# EAGLE design eeZeeISP (EAGLE 6.4)
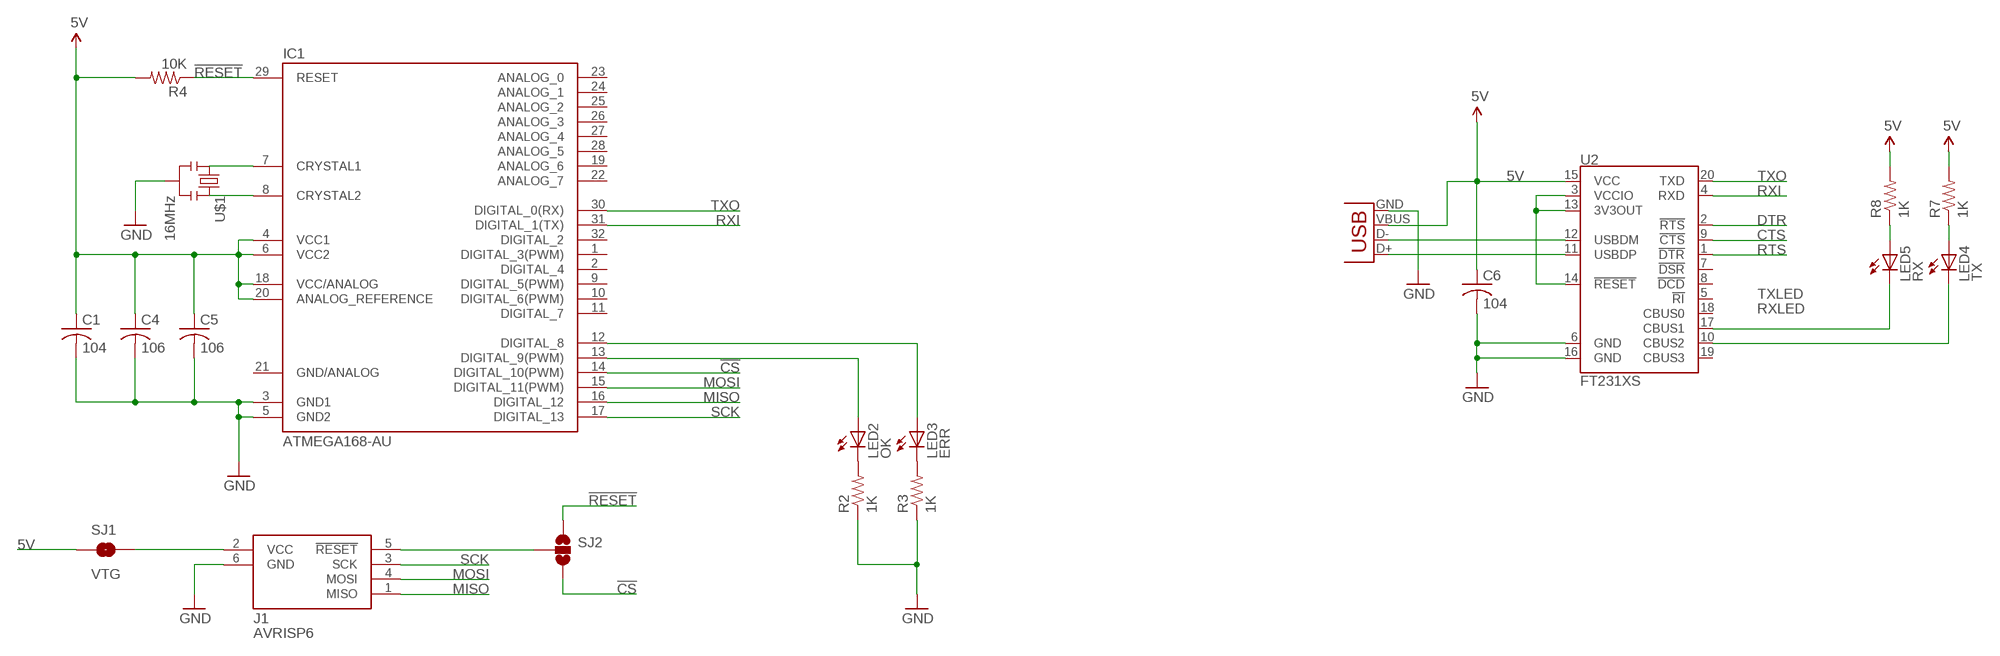
[diagram p0: schematic, sheet 1]

## Parts
C1  104  C-USC0603  [C0603]
C4  106  C-USC0603  [C0603]
C5  106  C-USC0603  [C0603]
C6  104  C-USC0603  [C0603]
IC1  ATMEGA168-AU  [TQFP32-08]
J1  AVRISP6  [CON6P2R]
LED2  OK  LEDCHIPLED_1206  [CHIPLED_1206]
LED3  ERR  LEDCHIPLED_1206  [CHIPLED_1206]
LED4  TX  LEDCHIPLED_1206  [CHIPLED_1206]
LED5  RX  LEDCHIPLED_1206  [CHIPLED_1206]
R2  1K  R-US_R0603  [R0603]
R3  1K  R-US_R0603  [R0603]
R4  10K  R-US_R0603  [R0603]
R7  1K  R-US_R0603  [R0603]
R8  1K  R-US_R0603  [R0603]
SJ1  VTG  SOLDERJUMPERNO  [SJ_2S-NO]
SJ2  SOLDERJUMPER_2WAYS  [SJ_3]
U2  FT231XS  [SSOP20_L]
U$1  16MHz  RESONATOR_CSTCE_V_C  [CSTCE_V_C]
X2  USB-SMD-NS  [USB-MINIB-NOSTOP]

## Nets
5V: C1.1 C4.1 C5.1 C6.1 IC1.4(VCC1) IC1.6(VCC2) IC1.18(VCC/ANALOG) IC1.20(ANALOG_REFERENCE) R4.2 R7.2 R8.2 SJ1.1 U2.15(VCC) X2.VBUS
!CS: IC1.14(DIGITAL_10(PWM)) SJ2.3
!RESET: IC1.29(RESET) R4.1 SJ2.1
CTS: U2.9(!CTS)
DTR: U2.1(!DTR)
GND: C1.2 C4.2 C5.2 C6.2 IC1.3(GND1) IC1.5(GND2) J1.6(GND) R2.1 R3.1 U2.6(GND) U2.16(GND) U$1.GND X2.GND
MISO: IC1.16(DIGITAL_12) J1.1(MISO)
MOSI: IC1.15(DIGITAL_11(PWM)) J1.4(MOSI)
N$1: LED4.A R7.1
N$2: LED5.A R8.1
N$3: J1.2(VCC) SJ1.2
N$4: J1.5(!RESET) SJ2.2
N$6: IC1.13(DIGITAL_9(PWM)) LED2.A
N$7: IC1.12(DIGITAL_8) LED3.A
N$8: IC1.7(CRYSTAL1) U$1.X1
N$9: U2.3(VCCIO) U2.13(3V3OUT) U2.14(!RESET)
N$10: LED2.C R2.2
N$11: LED3.C R3.2
N$13: IC1.8(CRYSTAL2) U$1.X2
RTS: U2.2(!RTS)
RXI: IC1.31(DIGITAL_1(TX)) U2.4(RXD)
RXLED: LED5.C U2.17(CBUS1)
SCK: IC1.17(DIGITAL_13) J1.3(SCK)
TXLED: LED4.C U2.10(CBUS2)
TXO: IC1.30(DIGITAL_0(RX)) U2.20(TXD)
USB_D+: U2.11(USBDP) X2.D+
USB_D-: U2.12(USBDM) X2.D-
Unconnected: IC1.1(DIGITAL_3(PWM)) IC1.2(DIGITAL_4) IC1.9(DIGITAL_5(PWM)) IC1.10(DIGITAL_6(PWM)) IC1.11(DIGITAL_7) IC1.19(ANALOG_6) IC1.22(ANALOG_7) IC1.23(ANALOG_0) IC1.24(ANALOG_1) IC1.25(ANALOG_2) IC1.26(ANALOG_3) IC1.27(ANALOG_4) IC1.28(ANALOG_5) IC1.32(DIGITAL_2) U2.5(!RI) U2.7(!DSR) U2.8(!DCD) U2.18(CBUS0) U2.19(CBUS3)

## Power pins joined to a net without a drawn wire
GND/ANALOG: IC1.21(GND/ANALOG)

## Library data of the parts
C1 C4-C6 = rcl:C-US: CAPACITOR, American symbol
IC1 = Arduino-AVR:ATMEGA168
J1 = bt_avr:AVRISP6: 6-pin dual-row connector for Atmel AVRISP programmer interface
LED2-LED5 = bt_opto:LED: LED Various packages
R2-R4 R7 R8 = rcl:R-US_: RESISTOR, American symbol
SJ1 = SparkFun:SOLDERJUMPER: Solder Jumper Standard SMD solder jumper. Used to automate production. Two varients : Normally Open and Normally Closed are the same, but have different paste layers. NC will have a large amount of paste and should jumper during reflow.
SJ2 = SparkFun:SOLDERJUMPER_2WAY: Solder Jumper 2 way solder jumper
U2 = SparkFun-DigitalIC:FT231X: FTDI FT231X Full Speed USB to Full-handshake UART This USB2.0 Full Speed IC offers a compact bridge to full handshake UART interfaces. The device is a UART, capable of operating up to 3MBaud, with low power consumption (8mA). The FT231X includes the complete FT-X series feature set and enables USB to be added into a system design quickly and easily over a UART interface.
U$1 = bt_crystal:RESONATOR: Crystal Resonator, 3-pin
X2 = SparkFun:USB: USB Connectors USB-B-PTH is fully proven SKU : PRT-00139 USB-miniB is fully proven SKU : PRT-00587 USB-A-PCB is untested. USB-A-H is throughly reviewed, but untested. Spark Fun Electronics SKU : PRT-00437 USB-B-SMT is throughly reviewed, but untested. Needs silkscreen touching up. USB-A-S has not been used/tested USB-MB-H has not been used/tested

## Net classes
1 power: width 0.254 mm

## Board
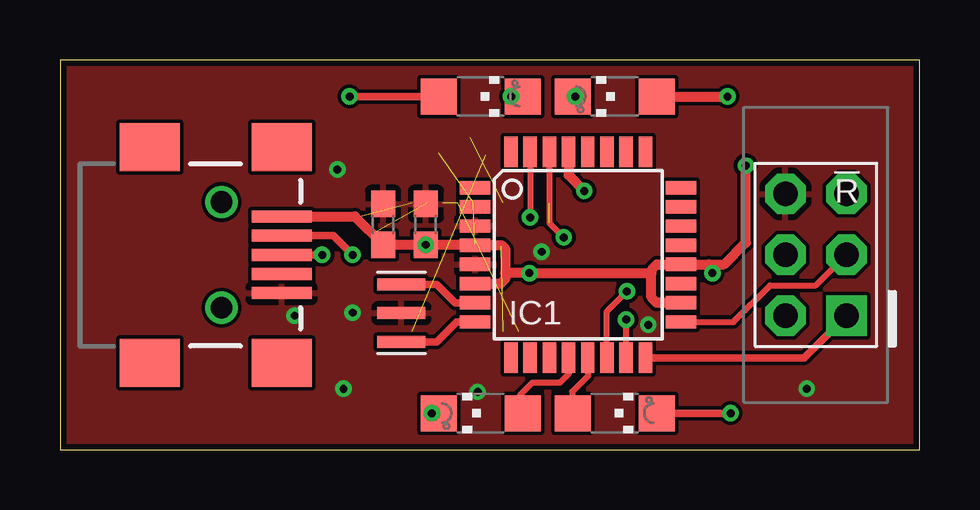
[diagram p1: board, top side]
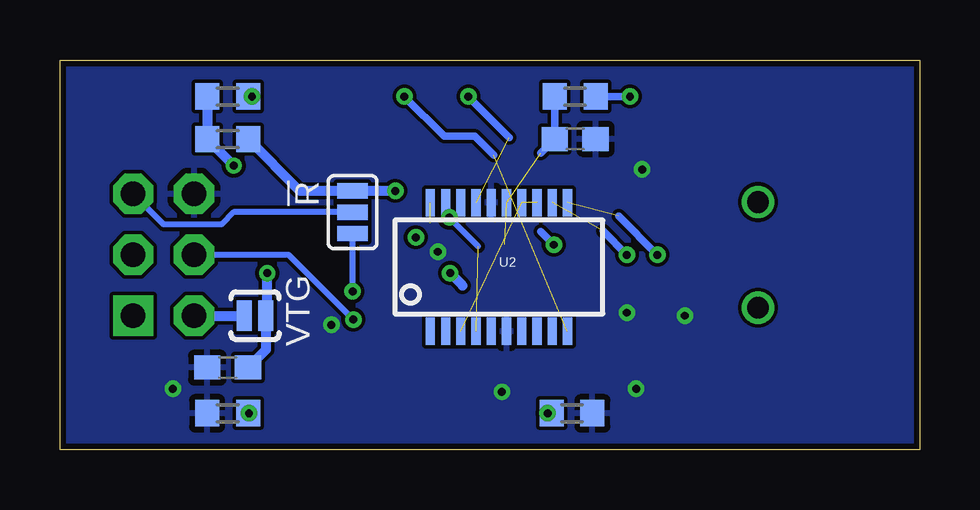
[diagram p2: board, bottom side, seen from below]

Size 35.81 x 16.26 mm. Coordinates in mm from the lower left corner, seen from the top.
Outline: 0,0 35.81,0 35.81,16.26 0,16.26 0,0
Copper layers (1*16): Top 0.0356mm / dielectric 1.5011mm / Bottom 0.0356mm
Design rules "LaenPCBOrder *": minimum track width 6mil, minimum drill 13mil, track to track 6mil, track to pad 6mil, pad to pad 6mil, via to via 6mil, smd to smd 6mil, copper to edge 10mil, drill to drill 6mil, minimum pad ring 7mil, minimum via ring 7mil, stop-mask expansion 4mil, vias tented up to drill 20mil, thermal gap 10mil

### Footprints (pad centres in the part's own frame; a part is rotated, then mirrored left to right if it is on the bottom)
C0603 = smd 1.1 x 1: 1 -0.85,0; 2 0.85,0
TQFP32-08 = smd 1.27 x 0.559: 1 -4.293,2.8; 2 -4.293,2; 3 -4.293,1.2; 4 -4.293,0.4; 5 -4.293,-0.4; 6 -4.293,-1.2; 7 -4.293,-2; 8 -4.293,-2.8; 17 4.293,-2.8; 18 4.293,-2; 19 4.293,-1.2; 20 4.293,-0.4; 21 4.293,0.4; 22 4.293,1.2; 23 4.293,2; 24 4.293,2.8 | smd 0.559 x 1.27: 9 -2.8,-4.293; 10 -2,-4.293; 11 -1.2,-4.293; 12 -0.4,-4.293; 13 0.4,-4.293; 14 1.2,-4.293; 15 2,-4.293; 16 2.8,-4.293; 25 2.8,4.293; 26 2,4.293; 27 1.2,4.293; 28 0.4,4.293; 29 -0.4,4.293; 30 -1.2,4.293; 31 -2,4.293; 32 -2.8,4.293
CON6P2R = drill 1.016 pad 1.676 square: 1 -2.54,-1.27 | drill 1.016 pad 1.676 octagon: 2 -2.54,1.27; 3 0,-1.27; 4 0,1.27; 5 2.54,-1.27; 6 2.54,1.27
CHIPLED_1206 = smd 1.5 x 1.5: A 0,-1.75; C 0,1.75
R0603 = smd 1 x 1.1: 1 -0.85,0; 2 0.85,0
SJ_2S-NO = smd 0.635 x 1.27: 1 -0.45,0; 2 0.45,0
SJ_3 = smd 0.635 x 1.27: 1 -0.889,0; 2 0,0; 3 0.889,0
SSOP20_L = smd 0.381 x 1.143: 1 -2.857,-2.68; 2 -2.223,-2.68; 3 -1.587,-2.68; 4 -0.953,-2.68; 5 -0.318,-2.68; 6 0.318,-2.68; 7 0.953,-2.68; 8 1.587,-2.68; 9 2.223,-2.68; 10 2.857,-2.68; 11 2.857,2.68; 12 2.223,2.68; 13 1.587,2.68; 14 0.953,2.68; 15 0.318,2.68; 16 -0.318,2.68; 17 -0.953,2.68; 18 -1.587,2.68; 19 -2.223,2.68; 20 -2.857,2.68
CSTCE_V_C = smd 0.5 x 2: GND 0,0; X1 -1.2,0; X2 1.2,0
USB-MINIB-NOSTOP = smd 2.5 x 0.5: D+ 2.5,0; D- 2.5,0.8; GND 2.5,-1.6; ID 2.5,-0.8; VBUS 2.5,1.6 | smd 2.5 x 2: G1 -3,-4.5; G2 -3,4.5; G3 2.5,4.5; G4 2.5,-4.5 | drill 0.9 pad 0.8: H1 0,2.2 | drill 0.9 pad 0.787: H2 0,-2.2

### Placement (x,y rotation side)
C1  15.24,9.4 90 top
C4  13.46,9.4 90 top
C5  28.83,3.43 180 bottom
C6  14.35,12.95 0 bottom
IC1  21.59,8.13 0 top
J1  31.5,8.13 90 top
LED2  23.11,1.52 270 top
LED3  17.53,1.52 90 top
LED4  23.11,14.73 90 top
LED5  17.53,14.73 270 top
R2  28.83,1.52 0 bottom
R3  14.48,1.52 180 bottom
R4  28.83,12.95 180 bottom
R7  28.83,14.73 180 bottom
R8  14.35,14.73 180 bottom
SJ1  27.69,5.59 180 bottom
SJ2  23.62,9.91 270 bottom
U2  17.53,7.62 0 bottom
U$1  14.22,5.7 270 top
X2  6.73,8.13 0 top

### Tracks (layer width: path | path; a pad name or v marks a point on that pad's centre or on a via)
5V  (via drill 0.33)  (2 unrouted)
  Top 0.254: 27.18,7.6 27.05,7.73
  Top 0.406: IC1.6 18.36,6.93 18.54,7.11 18.54,7.37 | 18.54,7.37 18.54,8.38 18.4,8.53 IC1.4 17.28,8.55 C1.1 C4.1 12.28,9.73 X2.VBUS | IC1.18 24.86,6.13 24.64,6.35 24.64,7.37 | 24.64,7.37 24.64,7.49 24.87,7.73 IC1.20 27.05,7.73 27.67,7.73 28.57,8.64 v28.57,11.85 | 18.54,7.37 v19.56,7.37 24.64,7.37 | v27.18,7.37 27.18,7.6
  Bottom 0.254: 27.24,6.04 27.18,6.1
  Bottom 0.305: 15.79,9.1 C1.1 | 15.79,12.37 C6.1 R8.2
  Bottom 0.406: 19.04,6.85 v19.56,7.37 | R7.2 R4.2 v28.57,11.85 | C5.1 27.24,4.17 SJ1.1 27.24,6.04 | 27.18,6.1 v27.18,7.37
  other vias: 15.24,8.55
!CS  (via drill 0.33)
  Top 0.254: IC1.14 22.79,5.77 v23.62,6.6
  Bottom 0.254: v23.62,6.6 SJ2.3
!RESET  (via drill 0.33)
  Top 0.406: IC1.29 21.19,11.45 v21.84,10.79
  Bottom 0.406: v21.84,10.79 SJ2.1 25.82,10.79 R4.1
GND  (via drill 0.33)
  other vias: 9.78,5.59 11.56,11.68 11.81,2.54 31.11,2.54 20.07,8.26 17.4,2.41 12.19,5.71 24.51,5.21
  pour Top: 0,16.26 35.81,16.26 35.81,0 0,0
  pour Bottom: 0,16.26 35.81,16.26 35.81,0 0,0
MISO
  Top 0.305: IC1.16 31.01,3.83 J1.1
MOSI  (via drill 0.33)
  Top 0.254: IC1.15 v23.59,5.43
  Bottom 0.254: v23.59,5.43 26.29,8.13 J1.4
N$1  (via drill 0.33)
  Top 0.406: LED4.A v27.81,14.73
  Bottom 0.305: v27.81,14.73 R7.1
N$2  (via drill 0.33)
  Top 0.305: LED5.A v12.06,14.73
  Bottom 0.305: v12.06,14.73 R8.1
N$3
  Bottom 0.406: J1.2 SJ1.2
N$4
  Bottom 0.254: SJ2.2 28.57,9.91 29.08,9.4 31.5,9.4 J1.5
N$6
  Top 0.254: IC1.13 21.99,3.07 21.34,2.41 21.34,1.55 LED2.A
N$7
  Top 0.254: IC1.12 21.19,3.16 20.83,2.79 19.68,2.79 19.18,2.29 19.18,1.62 LED3.A
N$8
  Top 0.254: U$1.X1 14.62,6.9
  Top 0.305: IC1.7 16.47,6.13 15.7,6.9 14.62,6.9
N$9  (2 unrouted)
N$10  (via drill 0.33)
  Top 0.305: v27.94,1.52 LED2.C
  Bottom 0.305: R2.2 v27.94,1.52
N$11  (via drill 0.33)
  Top 0.305: v15.49,1.52 LED3.C
  Bottom 0.305: R3.2 v15.49,1.52
N$13
  Top 0.254: U$1.X2 14.62,4.5
  Top 0.305: IC1.8 16.53,5.33 15.7,4.5 14.62,4.5
RXI  (via drill 0.33)  (1 unrouted)
  Top 0.254: IC1.31 v19.59,9.68
  Bottom 0.254: v19.59,9.68 18.39,8.48
RXLED  (via drill 0.33)  (1 unrouted)
  Top 0.305: v18.8,14.73 LED5.C
  Bottom 0.305: 17.09,13.03 v18.8,14.73
SCK
  Top 0.254: IC1.17 28.06,5.33 29.59,6.86 31.5,6.86 J1.3
TXLED  (via drill 0.33)  (1 unrouted)
  Top 0.305: v21.46,14.73 LED4.C
  Bottom 0.305: 17.74,12.28 18.54,13.08 19.81,13.08 v21.46,14.73
TXO  (via drill 0.33)  (1 unrouted)
  Top 0.254: IC1.30 20.39,9.46 v20.99,8.86
USB_D+  (via drill 0.33)  (1 unrouted)
  Top 0.305: v10.92,8.13 X2.D+
  Bottom 0.305: 12.54,9.74 v10.92,8.13
USB_D-  (via drill 0.33)  (1 unrouted)
  Top 0.305: v12.19,8.13 11.39,8.93 X2.D-
  Bottom 0.305: 13.19,9.12 v12.19,8.13

### Text on the board
tNames: !R
bNames: !R | VTG